# Altium schematic sheet TWindow12.SchDoc: LiveDesign Evaluation - EvalBoard Tester
size A3; Organization: Altium Limited; Address1: L3, 12a Rodborough Rd; Address2: Frenchs Forest; Address3: NSW; Address4: Australia 2086; DocumentNumber: 15; SheetNumber: 15; SheetTotal: 16
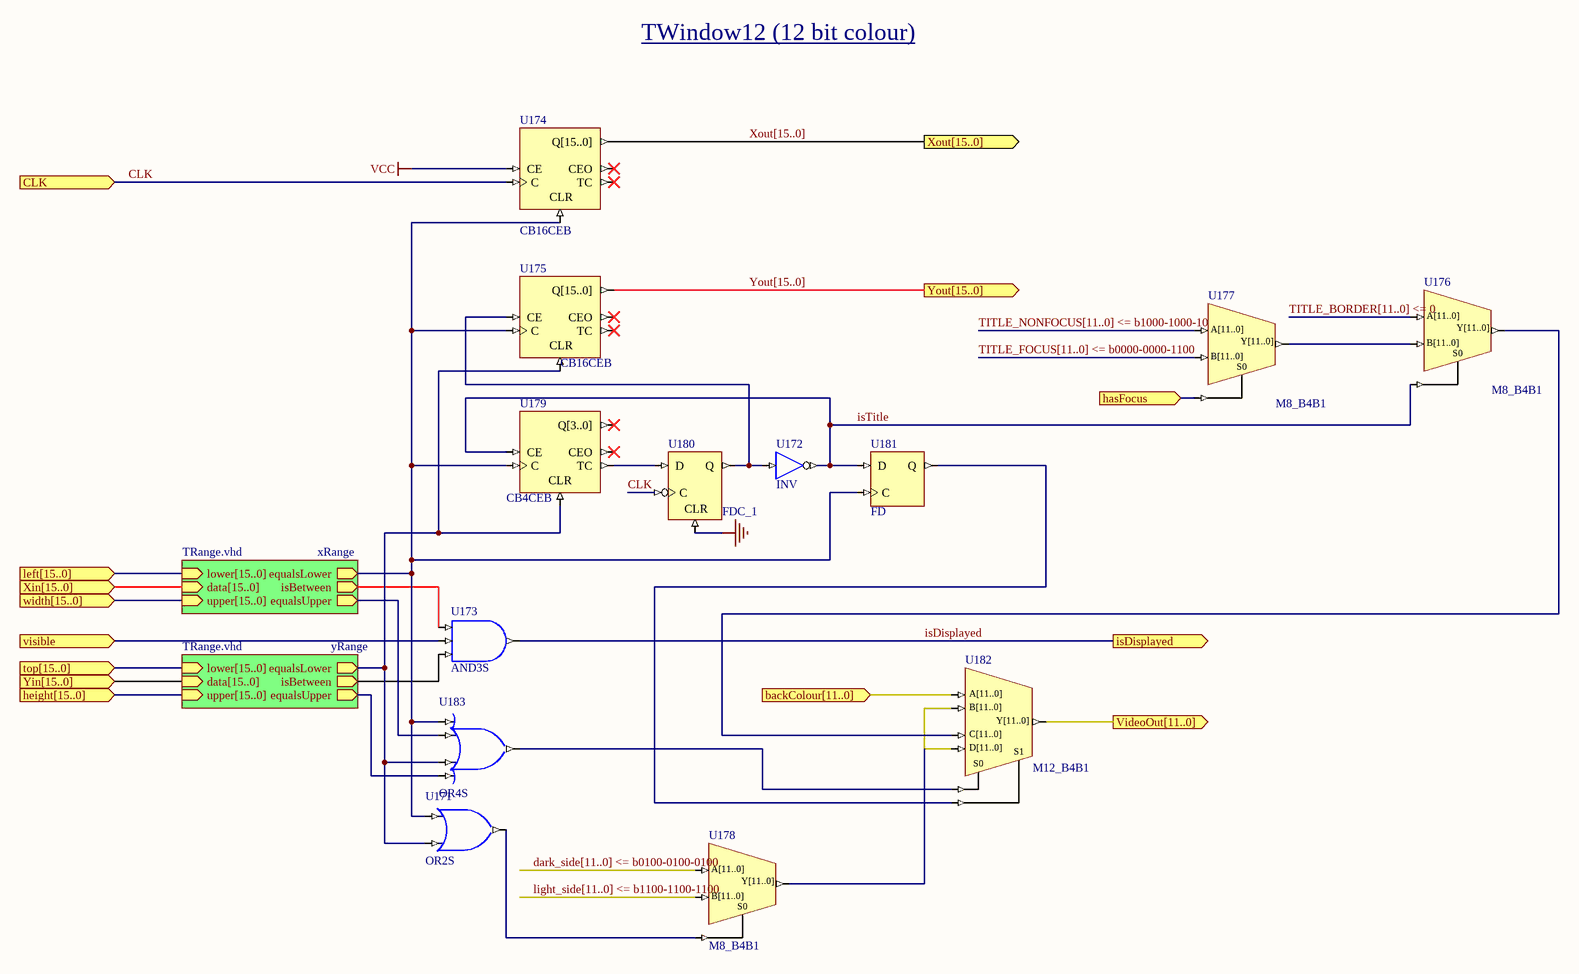
[diagram p0: TWindow12.SchDoc]

## Parts
U171  OR2S
U172  INV
U173  AND3S
U174  CB16CEB
U175  CB16CEB
U176  M8_B4B1
U177  M8_B4B1
U178  M8_B4B1
U179  CB4CEB
U180  FDC_1
U181  FD
U182  M12_B4B1
U183  OR4S

## Sub-sheets
xRange = TRange.vhd: lower[15..0] (in), data[15..0] (in), upper[15..0] (in), isBetween (out), equalsLower (out), equalsUpper (out)
yRange = TRange.vhd: lower[15..0] (in), data[15..0] (in), upper[15..0] (in), isBetween (out), equalsLower (out), equalsUpper (out)

## Ports
backColour[11..0] (in), CLK (in), hasFocus (in), height[15..0] (in), isDisplayed (out), left[15..0] (in), top[15..0] (in), VideoOut[11..0] (out), visible (in), width[15..0] (in), Xin[15..0] (in), Xout[15..0] (out), Yin[15..0] (in), Yout[15..0] (out)

## Nets
GND: U180.CLR
VCC: U174.CE
backColour[11..0]: U182.A[11..0] ; port backColour[11..0]
CLK: U174.C U180.C ; port CLK
dark_side[11..0] <= b0100-0100-0100: U178.A[11..0]
hasFocus: U177.S0 ; port hasFocus
isDisplayed: U173.O ; port isDisplayed
isTitle: U172.O U176.S0 U179.CE U181.D
light_side[11..0] <= b1100-1100-1100: U178.B[11..0]
TITLE_BORDER[11..0] <= 0: U176.A[11..0]
TITLE_FOCUS[11..0] <= b0000-0000-1100: U177.B[11..0]
TITLE_NONFOCUS[11..0] <= b1000-1000-1000: U177.A[11..0]
VideoOut[11..0]: U182.Y[11..0] ; port VideoOut[11..0]
visible: U173.I1 ; port visible
Xout[15..0]: U174.Q[15..0] ; port Xout[15..0]
Yout[15..0]: U175.Q[15..0] ; port Yout[15..0]
NetU171_I0: U171.I0 U174.CLR U175.C U179.C U181.C U183.I0 ; sheet xRange/equalsLower
NetU171_I1: U171.I1 U175.CLR U179.CLR U183.I2 ; sheet yRange/equalsLower
NetU171_O: U171.O U178.S0
NetU172_I: U172.I U175.CE U180.Q
NetU173_I0: U173.I0 ; sheet xRange/isBetween
NetU173_I2: U173.I2 ; sheet yRange/isBetween
NetU176_B[11..0]: U176.B[11..0] U177.Y[11..0]
NetU176_Y[11..0]: U176.Y[11..0] U182.C[11..0]
NetU178_Y[11..0]: U178.Y[11..0] U182.B[11..0] U182.D[11..0]
NetU179_TC: U179.TC U180.D
NetU181_Q: U181.Q U182.S1
NetU182_S0: U182.S0 U183.O
NetU183_I1: U183.I1 ; sheet xRange/equalsUpper
NetU183_I3: U183.I3 ; sheet yRange/equalsUpper

Not connected (* = marked no-connect by the designer): U174 CEO* TC*; U175 CEO* TC*; U179 CEO* Q[3..0]*

## Buses and harness runs
bus dark_side[11..0] <= b0100-0100-0100
bus light_side[11..0] <= b1100-1100-1100
bus port height[15..0] = sheet yRange/upper[15..0]
bus port left[15..0] = sheet xRange/lower[15..0]
bus port top[15..0] = sheet yRange/lower[15..0]
bus port width[15..0] = sheet xRange/upper[15..0]
bus port Xin[15..0] = sheet xRange/data[15..0]
bus port Yin[15..0] = sheet yRange/data[15..0]
bus TITLE_BORDER[11..0] <= 0
bus TITLE_FOCUS[11..0] <= b0000-0000-1100
bus TITLE_NONFOCUS[11..0] <= b1000-1000-1000
bus Xout[15..0] = port Xout[15..0]
bus Yout[15..0] = port Yout[15..0]

## Notes on the sheet
- TWindow12 (12 bit colour)
- Title
- Size:
- Date:
- A3
- Number:
- Time:
- Revision:
- Sheet
- of
- File:

## Library data of the parts
U171 = OR2S: 2-Input OR Gate, Single Pin Version; ArchiveName: GENERIC; VHDLIB_SIM: GENERIC_LIB; Xilinx Equivalent: OR2; Published: 29-Jan-2004; Publisher: Altium Limited; Core Revision: 1.00.00
U172 = INV: Inverter; ArchiveName: GENERIC; VHDLIB_SIM: GENERIC_LIB; Published: 29-Jan-2004; Publisher: Altium Limited; Xilinx Equivalent: INV; Core Revision: 1.00.00
U173 = AND3S: 3-Input AND Gate, Single Pin Version; ArchiveName: GENERIC; VHDLIB_SIM: GENERIC_LIB; Xilinx Equivalent: AND3; Published: 29-Jan-2004; Publisher: Altium Limited; Core Revision: 1.00.00
U174 U175 = CB16CEB: 16-Bit Cascadable Binary Counters with Clock Enable and Asynchronous Clear, Bus Version; Xilinx Equivalent: CB16CE; ArchiveName: GENERIC; VHDLIB_SIM: GENERIC_LIB; Published: 29-Jan-2004; Publisher: Altium Limited; Core Revision: 1.00.00
U176-U178 = M12_B2B1: 2x12-Bit Bus to 1x12-Bit Bus Multiplexer; ArchiveName: GENERIC; VHDLIB_SIM: GENERIC_LIB; Published: 29-Jan-2004; Publisher: Altium Limited; Core Revision: 1.00.00
U179 = CB4CEB: 4-Bit Cascadable Binary Counters with Clock Enable and Asynchronous Clear, Bus Version; ArchiveName: GENERIC; VHDLIB_SIM: GENERIC_LIB; Published: 29-Jan-2004; Publisher: Altium Limited; Core Revision: 1.00.00
U180 = FDC_1: D-Type Negative Edge Flip-Flop with Asynchronous Clear; ArchiveName: GENERIC; VHDLIB_SIM: GENERIC_LIB; Published: 29-Jan-2004; Publisher: Altium Limited; Xilinx Equivalent: FDC_1; Core Revision: 1.00.00
U181 = FD: D-Type Flip-Flop; ArchiveName: GENERIC; VHDLIB_SIM: GENERIC_LIB; Published: 29-Jan-2004; Publisher: Altium Limited; Xilinx Equivalent: FD; Core Revision: 1.00.00
U182 = M12_B4B1: 4x12-Bit Bus to 1x12-Bit Bus Multiplexer; ArchiveName: GENERIC; VHDLIB_SIM: GENERIC_LIB; Published: 29-Jan-2004; Publisher: Altium Limited; Core Revision: 1.00.00
U183 = OR4S: 4-Input OR Gate, Single Pin Version; ArchiveName: GENERIC; VHDLIB_SIM: GENERIC_LIB; Xilinx Equivalent: OR4; Published: 29-Jan-2004; Publisher: Altium Limited; Core Revision: 1.00.00